# EAGLE design keverő (EAGLE 6.5.0)
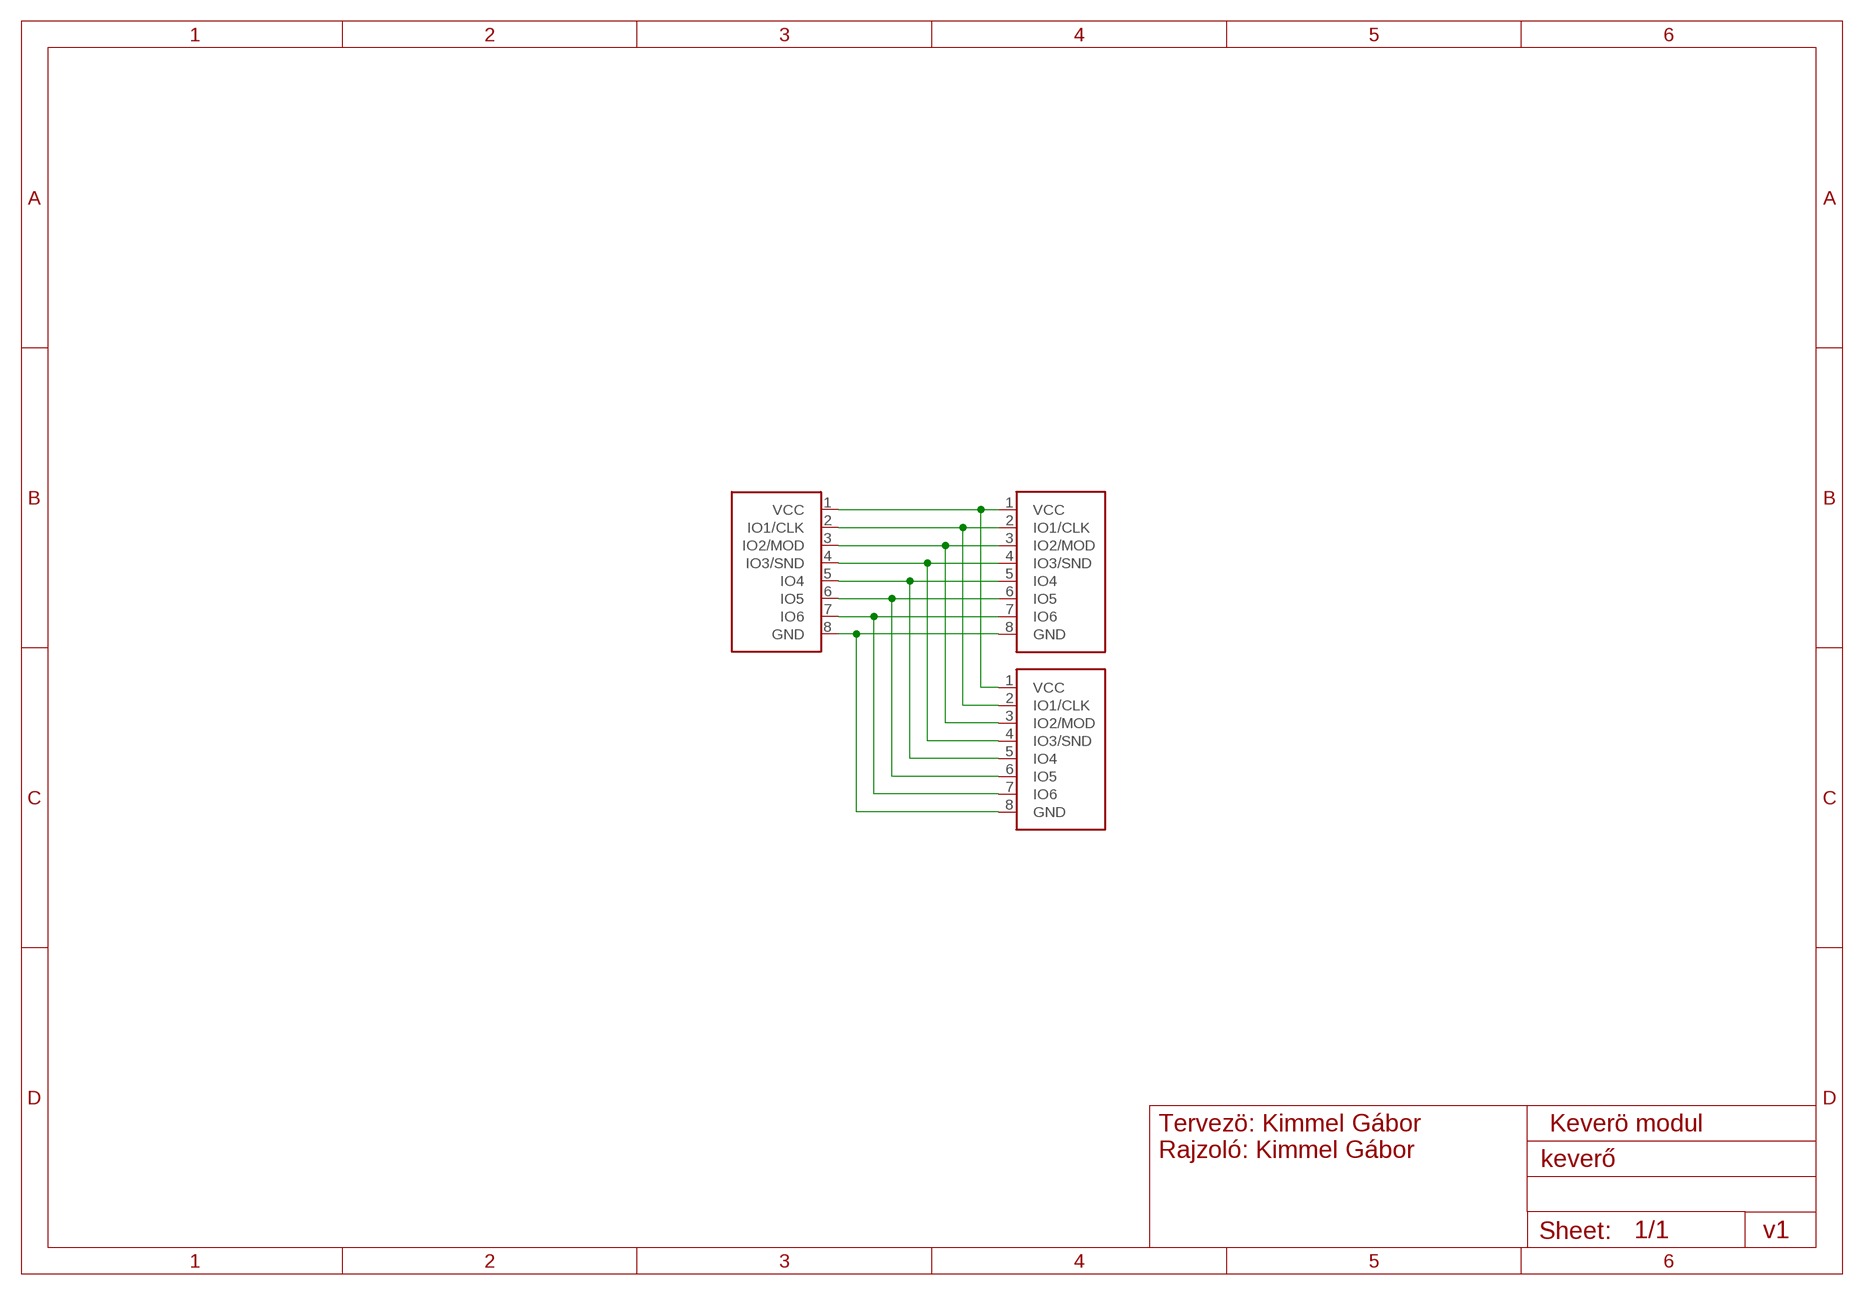
[diagram p0: schematic, sheet 1]

## Parts
U$1  GANZ-CONNECTOR-OUT  [MA08-1W]
U$2  GANZ-CONNECTOR  [FE08W]
U$3  GANZ-CONNECTOR  [FE08W]

## Nets
N$1: U$1.1(VCC) U$2.1(VCC) U$3.1(VCC)
N$2: U$1.2(IO1/CLK) U$2.2(IO1/CLK) U$3.2(IO1/CLK)
N$3: U$1.3(IO2/MOD) U$2.3(IO2/MOD) U$3.3(IO2/MOD)
N$4: U$1.4(IO3/SND) U$2.4(IO3/SND) U$3.4(IO3/SND)
N$5: U$1.5(IO4) U$2.5(IO4) U$3.5(IO4)
N$6: U$1.6(IO5) U$2.6(IO5) U$3.6(IO5)
N$7: U$1.7(IO6) U$2.7(IO6) U$3.7(IO6)
N$9: U$1.8(GND) U$2.8(GND) U$3.8(GND)

## Notes on the sheet
- Tervezö: Kimmel Gábor
  Rajzoló: Kimmel Gábor
- Keverö modul
- v1

## Library data of the parts
U$1 = ganzlib:GANZ-CONNECTOR-OUT
U$2 U$3 = ganzlib:GANZ-CONNECTOR

## Board
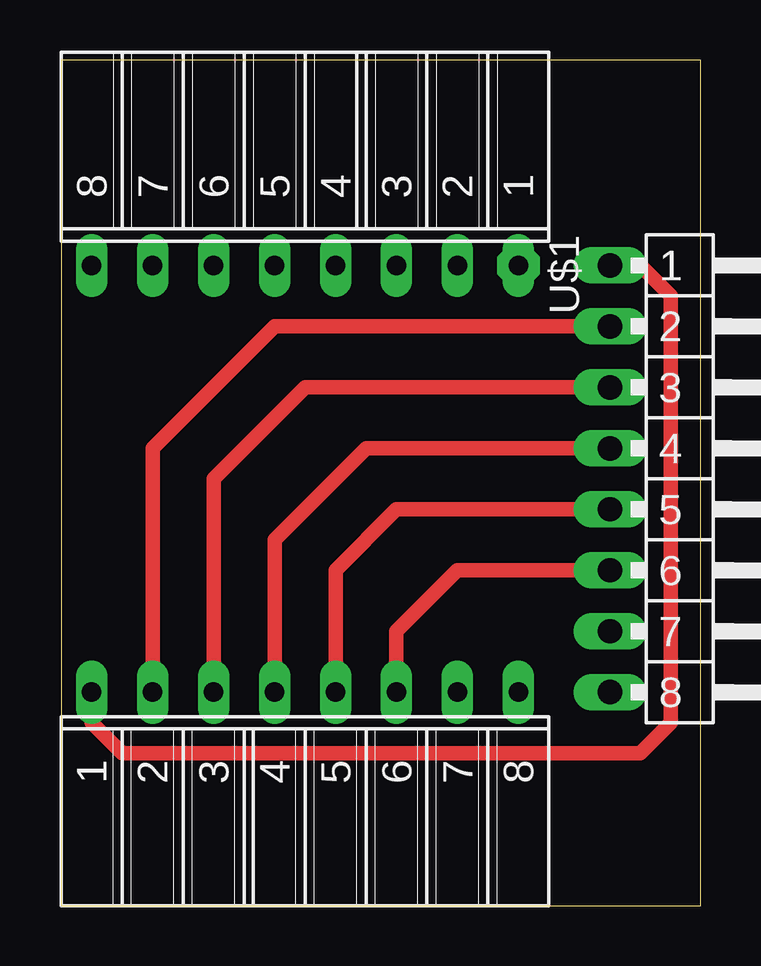
[diagram p1: board, top side]
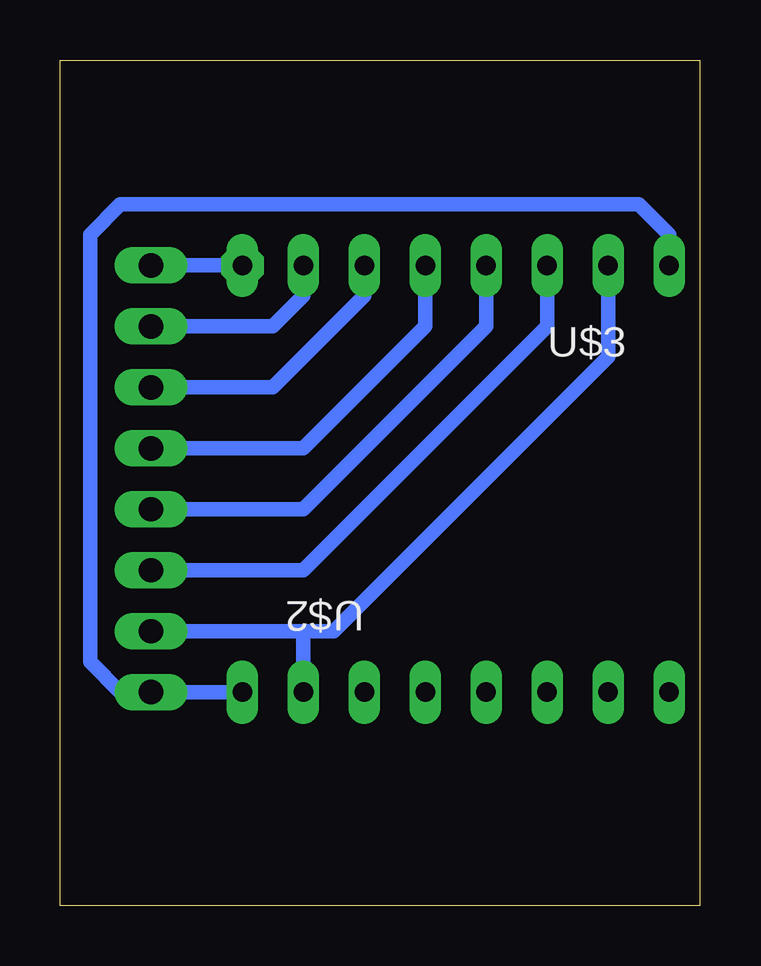
[diagram p2: board, bottom side, seen from below]

Size 26.65 x 35.23 mm. Coordinates in mm from the lower left corner, seen from the top.
Outline: 0,0 26.65,0 26.65,35.23 0,35.23 0,0
Copper layers (1*16): Top 0.035mm / dielectric 1.5mm / Bottom 0.035mm
Design rules "default *": minimum track width 10mil, minimum drill 24mil, track to track 8mil, track to pad 8mil, pad to pad 8mil, via to via 8mil, smd to smd 8mil, copper to edge 40mil, drill to drill 8mil, minimum pad ring 10mil, minimum via ring 8mil, stop-mask expansion 4mil, vias tented up to drill 0mil, thermal gap 10mil

### Footprints (pad centres in the part's own frame; a part is rotated, then mirrored left to right if it is on the bottom)
MA08-1W = drill 1.016 long: 1 0,8.89; 2 0,6.35; 3 0,3.81; 4 0,1.27; 5 0,-1.27; 6 0,-3.81; 7 0,-6.35; 8 0,-8.89
FE08W = drill 0.813 long: 1 5.08,8.89; 2 5.08,6.35; 3 5.08,3.81; 4 5.08,1.27; 5 5.08,-1.27; 6 5.08,-3.81; 7 5.08,-6.35; 8 5.08,-8.89

### Placement (x,y rotation side)
U$1  22.86,17.78 0 top
U$2  10.16,3.81 90 top
U$3  10.16,31.75 270 top

### Tracks (layer width: path | path; a pad name or v marks a point on that pad's centre or on a via)
N$1  (via drill 0.6 pad 1.78)
  Top 0.61: U$2.1 1.27,7.62 2.54,6.35 24.13,6.35 25.4,7.62 25.4,25.4 24.13,26.67 U$1.1
  Bottom 0.61: U$1.1 U$3.1
  other vias: 19.05,26.67
N$2
  Top 0.61: U$2.2 3.81,19.05 8.89,24.13 U$1.2
  Bottom 0.61: U$3.2 16.51,25.4 17.78,24.13 U$1.2
N$3
  Top 0.61: U$2.3 6.35,17.78 10.16,21.59 U$1.3
  Bottom 0.61: U$1.3 17.78,21.59 13.97,25.4 U$3.3
N$4
  Top 0.61: U$2.4 8.89,15.24 12.7,19.05 U$1.4
  Bottom 0.61: U$1.4 16.51,19.05 11.43,24.13 U$3.4
N$5
  Top 0.61: U$2.5 11.43,13.97 13.97,16.51 U$1.5
  Bottom 0.61: U$1.5 16.51,16.51 8.89,24.13 U$3.5
N$6
  Top 0.61: U$2.6 13.97,11.43 16.51,13.97 U$1.6
  Bottom 0.61: U$1.6 16.51,13.97 6.35,24.13 U$3.6
N$7
  Bottom 0.61: U$1.7 16.51,11.43 | 16.51,11.43 U$2.7 | U$3.7 3.81,22.86 15.24,11.43 16.51,11.43
N$9
  Bottom 0.61: U$2.8 U$1.8 24.13,8.89 25.4,10.16 25.4,27.94 24.13,29.21 2.54,29.21 1.27,27.94 U$3.8